# Altium schematic sheet schematic.schdoc
size A4
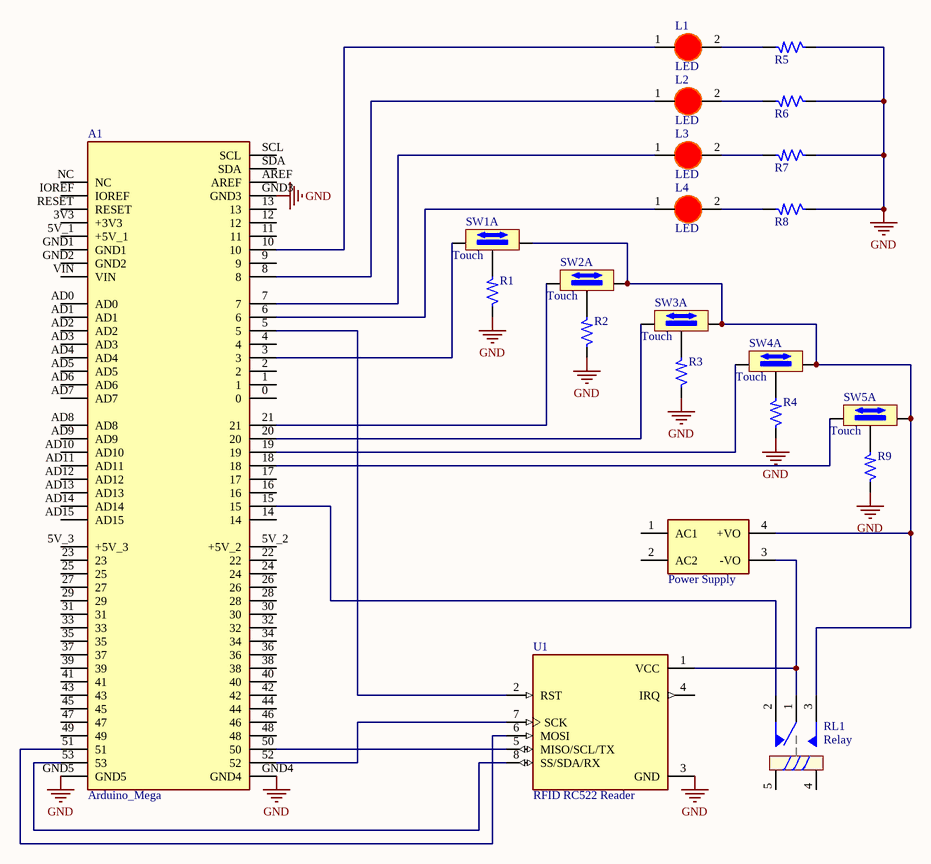
[diagram p0: schematic.schdoc]

## Parts
A1  Arduino_Mega  [Arduino_Mega]
L1  LED  [LED-5MM-RED]
L2  LED  [LED-5MM-RED]
L3  LED  [LED-5MM-RED]
L4  LED  [LED-5MM-RED]
Power_Supply  Chuyen nguon 5V  [Nguon HI-LINK 5M05]  (value not drawn)
R1  1k  [SM-1206]  (value not drawn)
R2  1k  [SM-1206]  (value not drawn)
R3  1k  [SM-1206]  (value not drawn)
R4  1k  [SM-1206]  (value not drawn)
R5  1k  [SM-1206]  (value not drawn)
R6  1k  [SM-1206]  (value not drawn)
R7  1k  [SM-1206]  (value not drawn)
R8  1k  [SM-1206]  (value not drawn)
R9  1k  [SM-1206]  (value not drawn)
RL1  Relay  [Relay 5 Chan SRD]
SW1  Touch  [SWDPDT_1.5x1]  (part A of 2)
SW2  Touch  [SWDPDT_1.5x1]  (part A of 2)
SW3  Touch  [SWDPDT_1.5x1]  (part A of 2)
SW4  Touch  [SWDPDT_1.5x1]  (part A of 2)
SW5  Touch  [SWDPDT_1.5x1]  (part A of 2)
U1  RFID RC522 Reader  [MODULE_CEG006900]

## Nets
GND: A1.GND3 A1.GND4 A1.GND5 R1.1 R2.1 R3.1 R4.1 R5.1 R6.1 R7.1 R8.1 R9.1 U1.3(GND)
NetA1_3: A1.3 SW1.1
NetA1_5: A1.5 U1.2(RST)
NetA1_6: A1.6 L4.1(A)
NetA1_7: A1.7 L3.1(A)
NetA1_8: A1.8 L2.1(A)
NetA1_10: A1.10 L1.1(A)
NetA1_15: A1.15 RL1.2
NetA1_18: A1.18 SW5.1
NetA1_19: A1.19 SW4.1
NetA1_20: A1.20 SW3.1
NetA1_21: A1.21 SW2.1
NetA1_50: A1.50 U1.5(MISO/SCL/TX)
NetA1_51: A1.51 U1.6(MOSI)
NetA1_52: A1.52 U1.7(SCK)
NetA1_53: A1.53 U1.8(SS/SDA/RX)
NetL1_2: L1.2(K) R5.2
NetL2_2: L2.2(K) R6.2
NetL3_2: L3.2(K) R7.2
NetL4_2: L4.2(K) R8.2
NetPower_Supply_3: Power_Supply.3(-VO) RL1.1 U1.1(VCC)
NetPower_Supply_4: Power_Supply.4(+VO) RL1.3 SW1.3 SW2.3 SW3.3 SW4.3 SW5.3
NetR1_2: R1.2 SW1.2
NetR2_2: R2.2 SW2.2
NetR3_2: R3.2 SW3.2
NetR4_2: R4.2 SW4.2
NetR9_2: R9.2 SW5.2

Not connected (* = marked no-connect by the designer): A1 0 1 2 3V3(+3V3) 4 5V_1(+5V_1) 5V_2(+5V_2) 5V_3(+5V_3) 9 11 12 13 14 16 17 22 23 24 25 26 27 28 29 30 31 32 33 34 35 36 37 38 39 40 41 42 43 44 45 46 47 48 49 AD0 AD1 AD2 AD3 AD4 AD5 AD6 AD7 AD8 AD9 AD10 AD11 AD12 AD13 AD14 AD15 AREF GND1 GND2 IOREF NC RESET SCL SDA VIN; Power_Supply 1(AC1) 2(AC2); RL1 4 5; U1 4(IRQ)

## Library data of the parts
A1 = Arduino_Mega: Arduino Mega 2560 Rev3. ATmega2560 Mikrodenetleyici Mega GeliÅŸtirme KartÄ± 16MHz CPU 8KB RAM 4KB/256KB EEPROM/Flash; MP: A000067; Price: None; Availability: In Stock; Package: Non-Standard Arduino; SnapEDA_Link: https://www.snapeda.com/parts/A000067/Arduino/view-part/?ref=snap; Check_prices: https://www.snapeda.com/parts/A000067/Arduino/view-part/?ref=eda; Value: *; Purchase-URL: https://pricing.snapeda.com/search/part/A000067/?ref=eda; MF: Arduino
L1-L4 = LED 5mm Do: Cắm; Don_Vi: Con; Ma_Hang: MH008967; Ten_Linh_Kien: Led 5MM Phủ Đỏ (1000c); Ghi_Chu: *; Kieu_Chan: *; Chung_Loai: Cắm
Power_Supply = Nguon Hi-Link HLK-5M05: AC DC 220V to 5V 5W 5Watt Isolated Switching Step-Down Power Supply Module Converter; Availability: Unavailable; SnapEDA_Link: https://www.snapeda.com/parts/HLK-5M05/Hi-link/view-part/2758659/?ref=snap; MF: Hi-link; Price: None; Package: Package Analog Devices; MP: HLK-5M05; Value: *
R1-R9 = R: Resistor 1/4W; Value: R1/4W - 1K
RL1 = Relay 5 Chan SRD: Relay 5 Chan; Ma_Hang: MH009374; Ten: Relay 5V10A SRD-05VDC-SL-C Chính Hãng
SW1-SW5 = SWDPDT: Switch SPDT; Creat by: VanDungEvn@Gmail.com
U1 = CEG006900: RFID RC522 Reader IC Card Module Tags SPI Interface Read and Write; MF: YKS; Value: *; SnapEDA_Link: https://www.snapeda.com/parts/CEG006900/YKS/view-part/?ref=snap; MP: CEG006900; Check_prices: https://www.snapeda.com/parts/CEG006900/YKS/view-part/?ref=eda; Availability: Not in stock; Price: None; Package: None